# EasyEDA schematic SCH_StairLights_2023-11-12.json
TITLE: Sheet_1; REV: 1.0; Date: 2022-04-26; Sheet: 1/1; Drawn By: budij; Company: Your Company
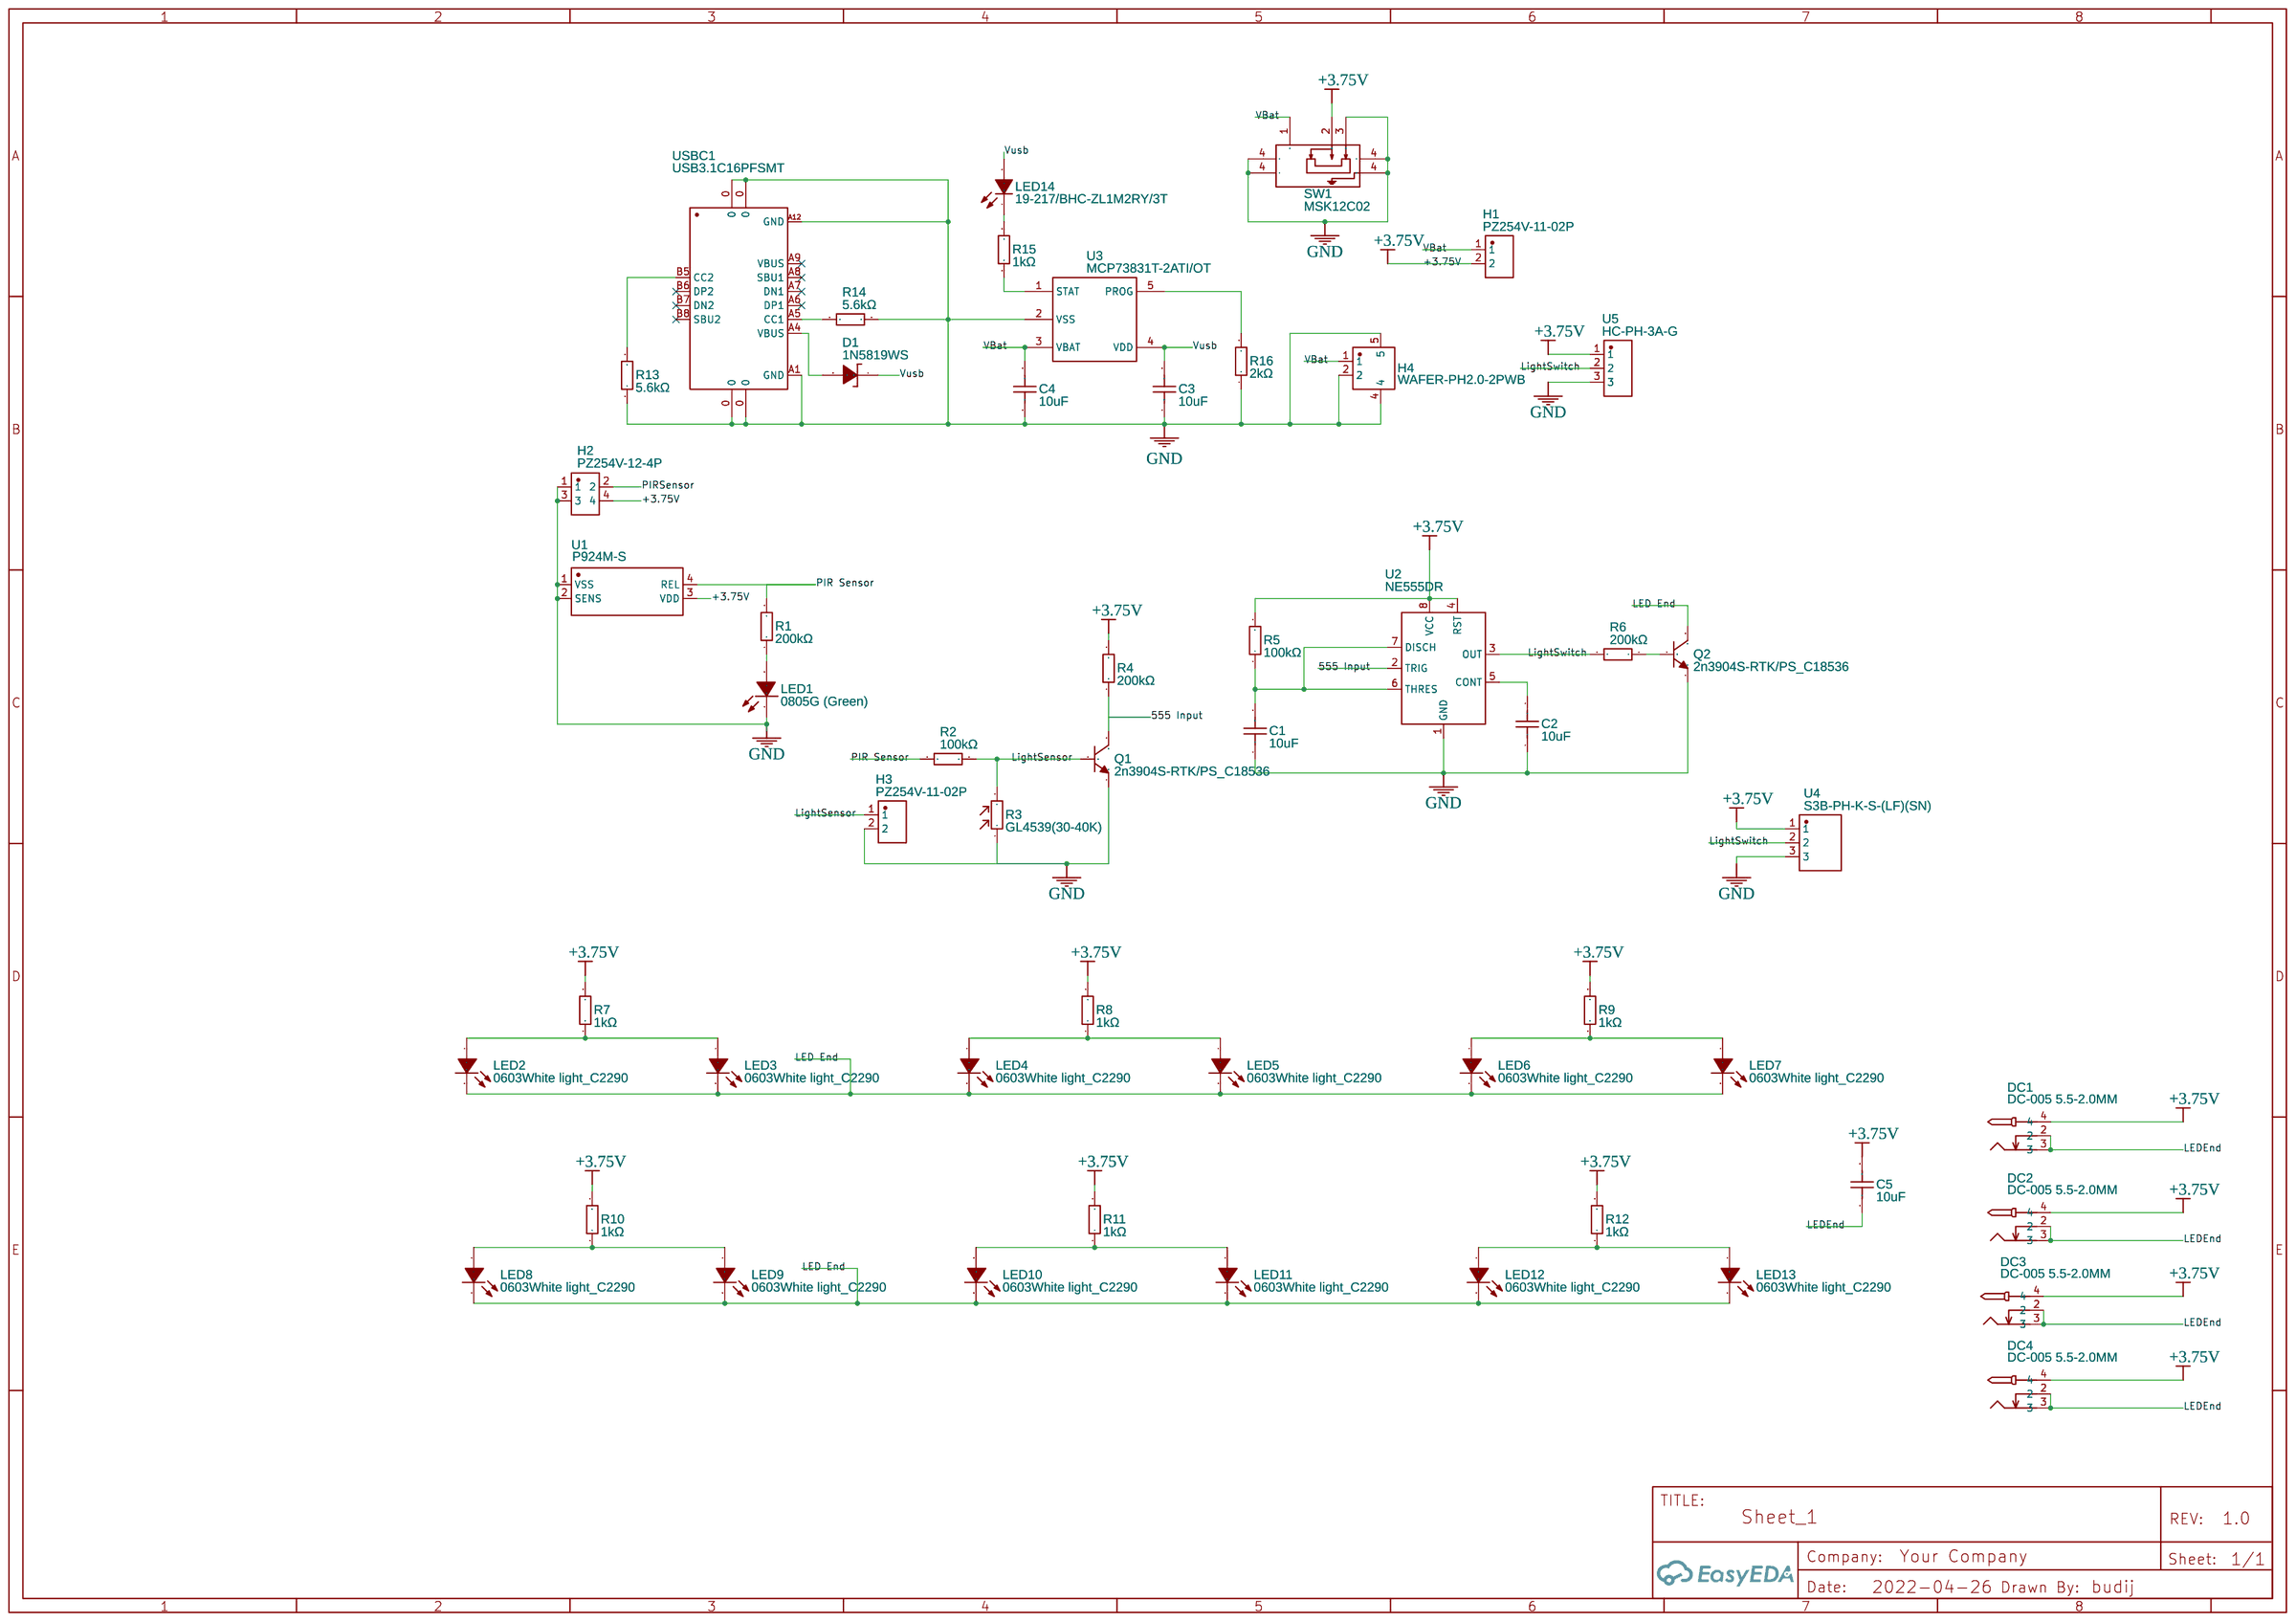
[diagram p0: schematic sheet]

## Parts
C1  10uF  [C0603]
C2  10uF  [C0603]
C3  10uF  [C0603]
C4  10uF  [C0603]
C5  10uF  [C0603]
D1  1N5819WS  [SOD-323_L1.8-W1.3-LS2.5-RD]
DC1  DC-005 5.5-2.0MM  [DC-IN-TH_DC-5520-1]
DC2  DC-005 5.5-2.0MM  [DC-IN-TH_DC-5520-1]
DC3  DC-005 5.5-2.0MM  [DC-IN-TH_DC-5520-1]
DC4  DC-005 5.5-2.0MM  [DC-IN-TH_DC-5520-1]
H1  PZ254V-11-02P  [HDR-TH_2P-P2.54-V-M]
H2  PZ254V-12-4P  [HDR-TH_4P-P2.54-V-M-R2-C2-S2.54]
H3  PZ254V-11-02P  [HDR-TH_2P-P2.54-V-M]
H4  WAFER-PH2.0-2PWB  [CONN-SMD_2P-P2.00_XUNPU_WAFER-PH2.0-2PWB]
LED1  0805G (Green)  [LED0805-RD_GREEN]
LED2  0603White light_C2290  [LED0603-R-RD_WHITE]
LED3  0603White light_C2290  [LED0603-R-RD_WHITE]
LED4  0603White light_C2290  [LED0603-R-RD_WHITE]
LED5  0603White light_C2290  [LED0603-R-RD_WHITE]
LED6  0603White light_C2290  [LED0603-R-RD_WHITE]
LED7  0603White light_C2290  [LED0603-R-RD_WHITE]
LED8  0603White light_C2290  [LED0603-R-RD_WHITE]
LED9  0603White light_C2290  [LED0603-R-RD_WHITE]
LED10  0603White light_C2290  [LED0603-R-RD_WHITE]
LED11  0603White light_C2290  [LED0603-R-RD_WHITE]
LED12  0603White light_C2290  [LED0603-R-RD_WHITE]
LED13  0603White light_C2290  [LED0603-R-RD_WHITE]
LED14  19-217/BHC-ZL1M2RY/3T  [LED0603-FD_BLUE]
Q1  2n3904S-RTK/PS_C18536  [SOT-23-3_L2.9-W1.3-P1.90-LS2.4-TR]
Q2  2n3904S-RTK/PS_C18536  [SOT-23-3_L2.9-W1.3-P1.90-LS2.4-TR]
R1  200kΩ  [R0603]
R2  100kΩ  [R0603]
R3  GL4539(30-40K)  [RES-TH_L4.1-W3.4-P2.50_GL45]
R4  200kΩ  [R0603]
R5  100kΩ  [R0603]
R6  200kΩ  [R0603]
R7  1kΩ  [R0603]
R8  1kΩ  [R0603]
R9  1kΩ  [R0603]
R10  1kΩ  [R0603]
R11  1kΩ  [R0603]
R12  1kΩ  [R0603]
R13  5.6kΩ  [R0603]
R14  5.6kΩ  [R0603]
R15  1kΩ  [R0603]
R16  2kΩ  [R0603]
SW1  MSK12C02  [SW-TH_MSK12C02]
U1  P924M-S  [PIR-TH_P924M-S]
U2  NE555DR  [SOIC-8_L4.9-W3.9-P1.27-LS6.0-BL]
U3  MCP73831T-2ATI/OT  [SOT-23-5_L3.0-W1.7-P0.95-LS2.8-BR]
U4  S3B-PH-K-S-(LF)(SN)  [CONN-TH_3P-P2.00_S3B-PH-K-S-LF-SN]
U5  HC-PH-3A-G  [CONN-TH_3P-P2.00_HCTL_HC-PH-3A-X]
USBC1  USB3.1C16PFSMT  [USB-C-SMD_TYPE-C-USB-17]

## Library data of the parts
C1-C5 = CL10A106KP8NNNC: Supplier: LCSC; Manufacturer: SAMSUNG(三星); Supplier Part: C19702; JLCPCB Part Class: Basic Part
D1 = 1N5819WS: Supplier: LCSC; Supplier Part: C191023; Manufacturer: Hottech(合科泰); Contributor: LCSC; JLCPCB Part Class: Basic Part
DC1-DC4 = DC-005 5.5-2.0MM: Supplier: LCSC; Manufacturer: BOOMELE(博穆精密); Manufacturer Part: DC-005 2.0; Supplier Part: C16214; JLCPCB Part Class: Extended Part; link: https://lcsc.com/eda_search?q=C16214&%26type=1&ref=editor
H1 H3 = PZ254V-11-02P: Supplier: LCSC; Supplier Part: C492401; Manufacturer: XFCN; Contributor: LCSC; JLCPCB Part Class: Extended Part
H2 = PZ254V-12-4P: Supplier: LCSC; Supplier Part: C492419; Manufacturer: XFCN(兴飞); Contributor: LCSC; JLCPCB Part Class: Extended Part
H4 = WAFER-PH2.0-2PWB: Supplier: LCSC; Supplier Part: C3029440; Manufacturer: XUNPU(讯普); link: https://atta.szlcsc.com/upload/public/pdf/source/20220527/83903C18429EFE4C9EEE8C529A248431.pdf; Contributor: lcsc; JLCPCB Part Class: Extended Part
LED1 = 0805G (Green): Supplier: LCSC; Manufacturer: KENTO; Supplier Part: C2297; JLCPCB Part Class: Basic Part
LED2-LED13 = 0603White light_C2290: Supplier: LCSC; Manufacturer: null; Manufacturer Part: KT-0603白灯; Supplier Part: C2290; JLCPCB Part Class: Basic Part
LED14 = 19-217/BHC-ZL1M2RY/3T: Supplier: LCSC; Manufacturer: EVERLIGHT(亿光); Supplier Part: C72041; JLCPCB Part Class: Basic Part
Q1 Q2 = 2n3904S-RTK/PS_C18536: Supplier: LCSC; Manufacturer: KEC; Manufacturer Part: 2n3904S-RTK/PS; Supplier Part: C18536; JLCPCB Part Class: Extended Part
R1 R4 R6 = 0603WAF2003T5E: Supplier: LCSC; Manufacturer: UNI-ROYAL(厚声); Supplier Part: C25811; Resistance (Ohms): 200K; JLCPCB Part Class: Basic Part
R2 R5 = 0603WAF1003T5E: Supplier: LCSC; Manufacturer: UNI-ROYAL(厚声); Supplier Part: C25803; Resistance (Ohms): 100K; JLCPCB Part Class: Basic Part
R3 = GL4539(30-40K): Supplier: LCSC; Manufacturer: ReliaPro; Supplier Part: C11295; JLCPCB Part Class: Extended Part
R7-R12 R15 = 0603WAF1001T5E: Supplier: LCSC; Manufacturer: UNI-ROYAL(厚声); Supplier Part: C21190; Resistance (Ohms): 1K; JLCPCB Part Class: Basic Part
R13 R14 = 0603WAF5601T5E: Supplier: LCSC; Manufacturer: UNI-ROYAL(厚声); Supplier Part: C23189; Resistance (Ohms): 5.6K; JLCPCB Part Class: Basic Part
R16 = 0603WAF2001T5E: Supplier: LCSC; Manufacturer: UNI-ROYAL(厚声); Supplier Part: C22975; Resistance (Ohms): 2K; JLCPCB Part Class: Basic Part
SW1 = MSK12C02: Supplier: LCSC; Supplier Part: C431540; Manufacturer: SHOU HAN(首韩); Contributor: LCSC; JLCPCB Part Class: Extended Part
U1 = P924M-S: Supplier: LCSC; Manufacturer: Nicera; Contributor: LCSC; Supplier Part: C139580; LCSC Assembly: Yes; SMT Type: Extend; Paste Type: expand
U2 = NE555DR: Supplier: LCSC; Manufacturer: TI; Supplier Part: C7593; JLCPCB Part Class: Basic Part
U3 = MCP73831T-2ATI/OT: Supplier: LCSC; Manufacturer: MICROCHIP; Supplier Part: C14879; JLCPCB Part Class: Extended Part
U4 = S3B-PH-K-S-(LF)(SN): Supplier: LCSC; Supplier Part: C157929; Manufacturer: JST; Manufacturer Part: S3B-PH-K-S(LF)(SN); Contributor: LCSC; JLCPCB Part Class: Extended Part
U5 = HC-PH-3A-G: Supplier: LCSC; Supplier Part: C5342436; Manufacturer: HCTL(华灿天禄); link: https://atta.szlcsc.com/upload/public/pdf/source/20230314/FA21A5F04C20439CEC575C86BF35148D.pdf; Contributor: lcsc
USBC1 = USB3.1C16PFSMT: Supplier: LCSC; Supplier Part: C167321; Manufacturer: LCSC; Contributor: LCSC; JLCPCB Part Class: Extended Part

## Nets
+3.75V: C5.2 DC1.4 DC2.4 DC3.4 DC4.4 H1.2 H2.4 R4.2 R5.2 R7.2 R8.2 R9.2 R10.2 R11.2 R12.2 SW1.2 U1.3(VDD) U2.4(RST) U2.8(VCC) U4.1 U5.1
GND: C1.1 C2.1 C3.1 C4.1 H2.1 H2.3 H3.2 H4.2 H4.4 H4.5 LED1.1(K) Q1.1(E) Q2.1(E) R3.1 R13.1 R14.2 R16.1 SW1.3 SW1.4 U1.1(VSS) U1.2(SENS) U2.1(GND) U3.2(VSS) U4.3 U5.3 USBC1.0 USBC1.A1(GND) USBC1.A12(GND)
VBat: C4.2 H1.1 H4.1 SW1.1 U3.3(VBAT)
555 Input: Q1.3(C) R4.1 U2.2(TRIG)
LED End: LED2.2(K) LED3.2(K) LED4.2(K) LED5.2(K) LED6.2(K) LED7.2(K) LED8.2(K) LED9.2(K) LED10.2(K) LED11.2(K) LED12.2(K) LED13.2(K) Q2.3(C)
LEDEnd: C5.1 DC1.2 DC1.3 DC2.2 DC2.3 DC3.2 DC3.3 DC4.2 DC4.3
LightSensor: H3.1 Q1.2(B) R2.2 R3.2
LightSwitch: R6.2 U2.3(OUT) U4.2 U5.2
PIR Sensor: R1.2 R2.1 U1.4(REL)
PIRSensor: H2.2
Vusb: C3.2 D1.1(C) LED14.2(A) U3.4(VDD)
Net-(C1-2): C1.2 R5.1 U2.6(THRES) U2.7(DISCH)
Net-(C2-2): C2.2 U2.5(CONT)
Net-(D1-2): D1.2(A) USBC1.A4(VBUS)
Net-(LED1-2): LED1.2(A) R1.1
Net-(LED2-1): LED2.1(A) LED3.1(A) R7.1
Net-(LED4-1): LED4.1(A) LED5.1(A) R8.1
Net-(LED6-1): LED6.1(A) LED7.1(A) R9.1
Net-(LED8-1): LED8.1(A) LED9.1(A) R10.1
Net-(LED10-1): LED10.1(A) LED11.1(A) R11.1
Net-(LED12-1): LED12.1(A) LED13.1(A) R12.1
Net-(LED14-1): LED14.1(C) R15.2
Net-(Q2-2): Q2.2(B) R6.1
Net-(R13-2): R13.2 USBC1.B5(CC2)
Net-(R14-1): R14.1 USBC1.A5(CC1)
Net-(R15-1): R15.1 U3.1(STAT)
Net-(R16-2): R16.2 U3.5(PROG)

Not connected (* = marked no-connect by the designer): USBC1 A6(DP1)* A7(DN1)* A8(SBU1)* A9(VBUS)* B6(DP2)* B7(DN2)* B8(SBU2)*
